# Altium schematic sheet imu_analog.SchDoc
size C
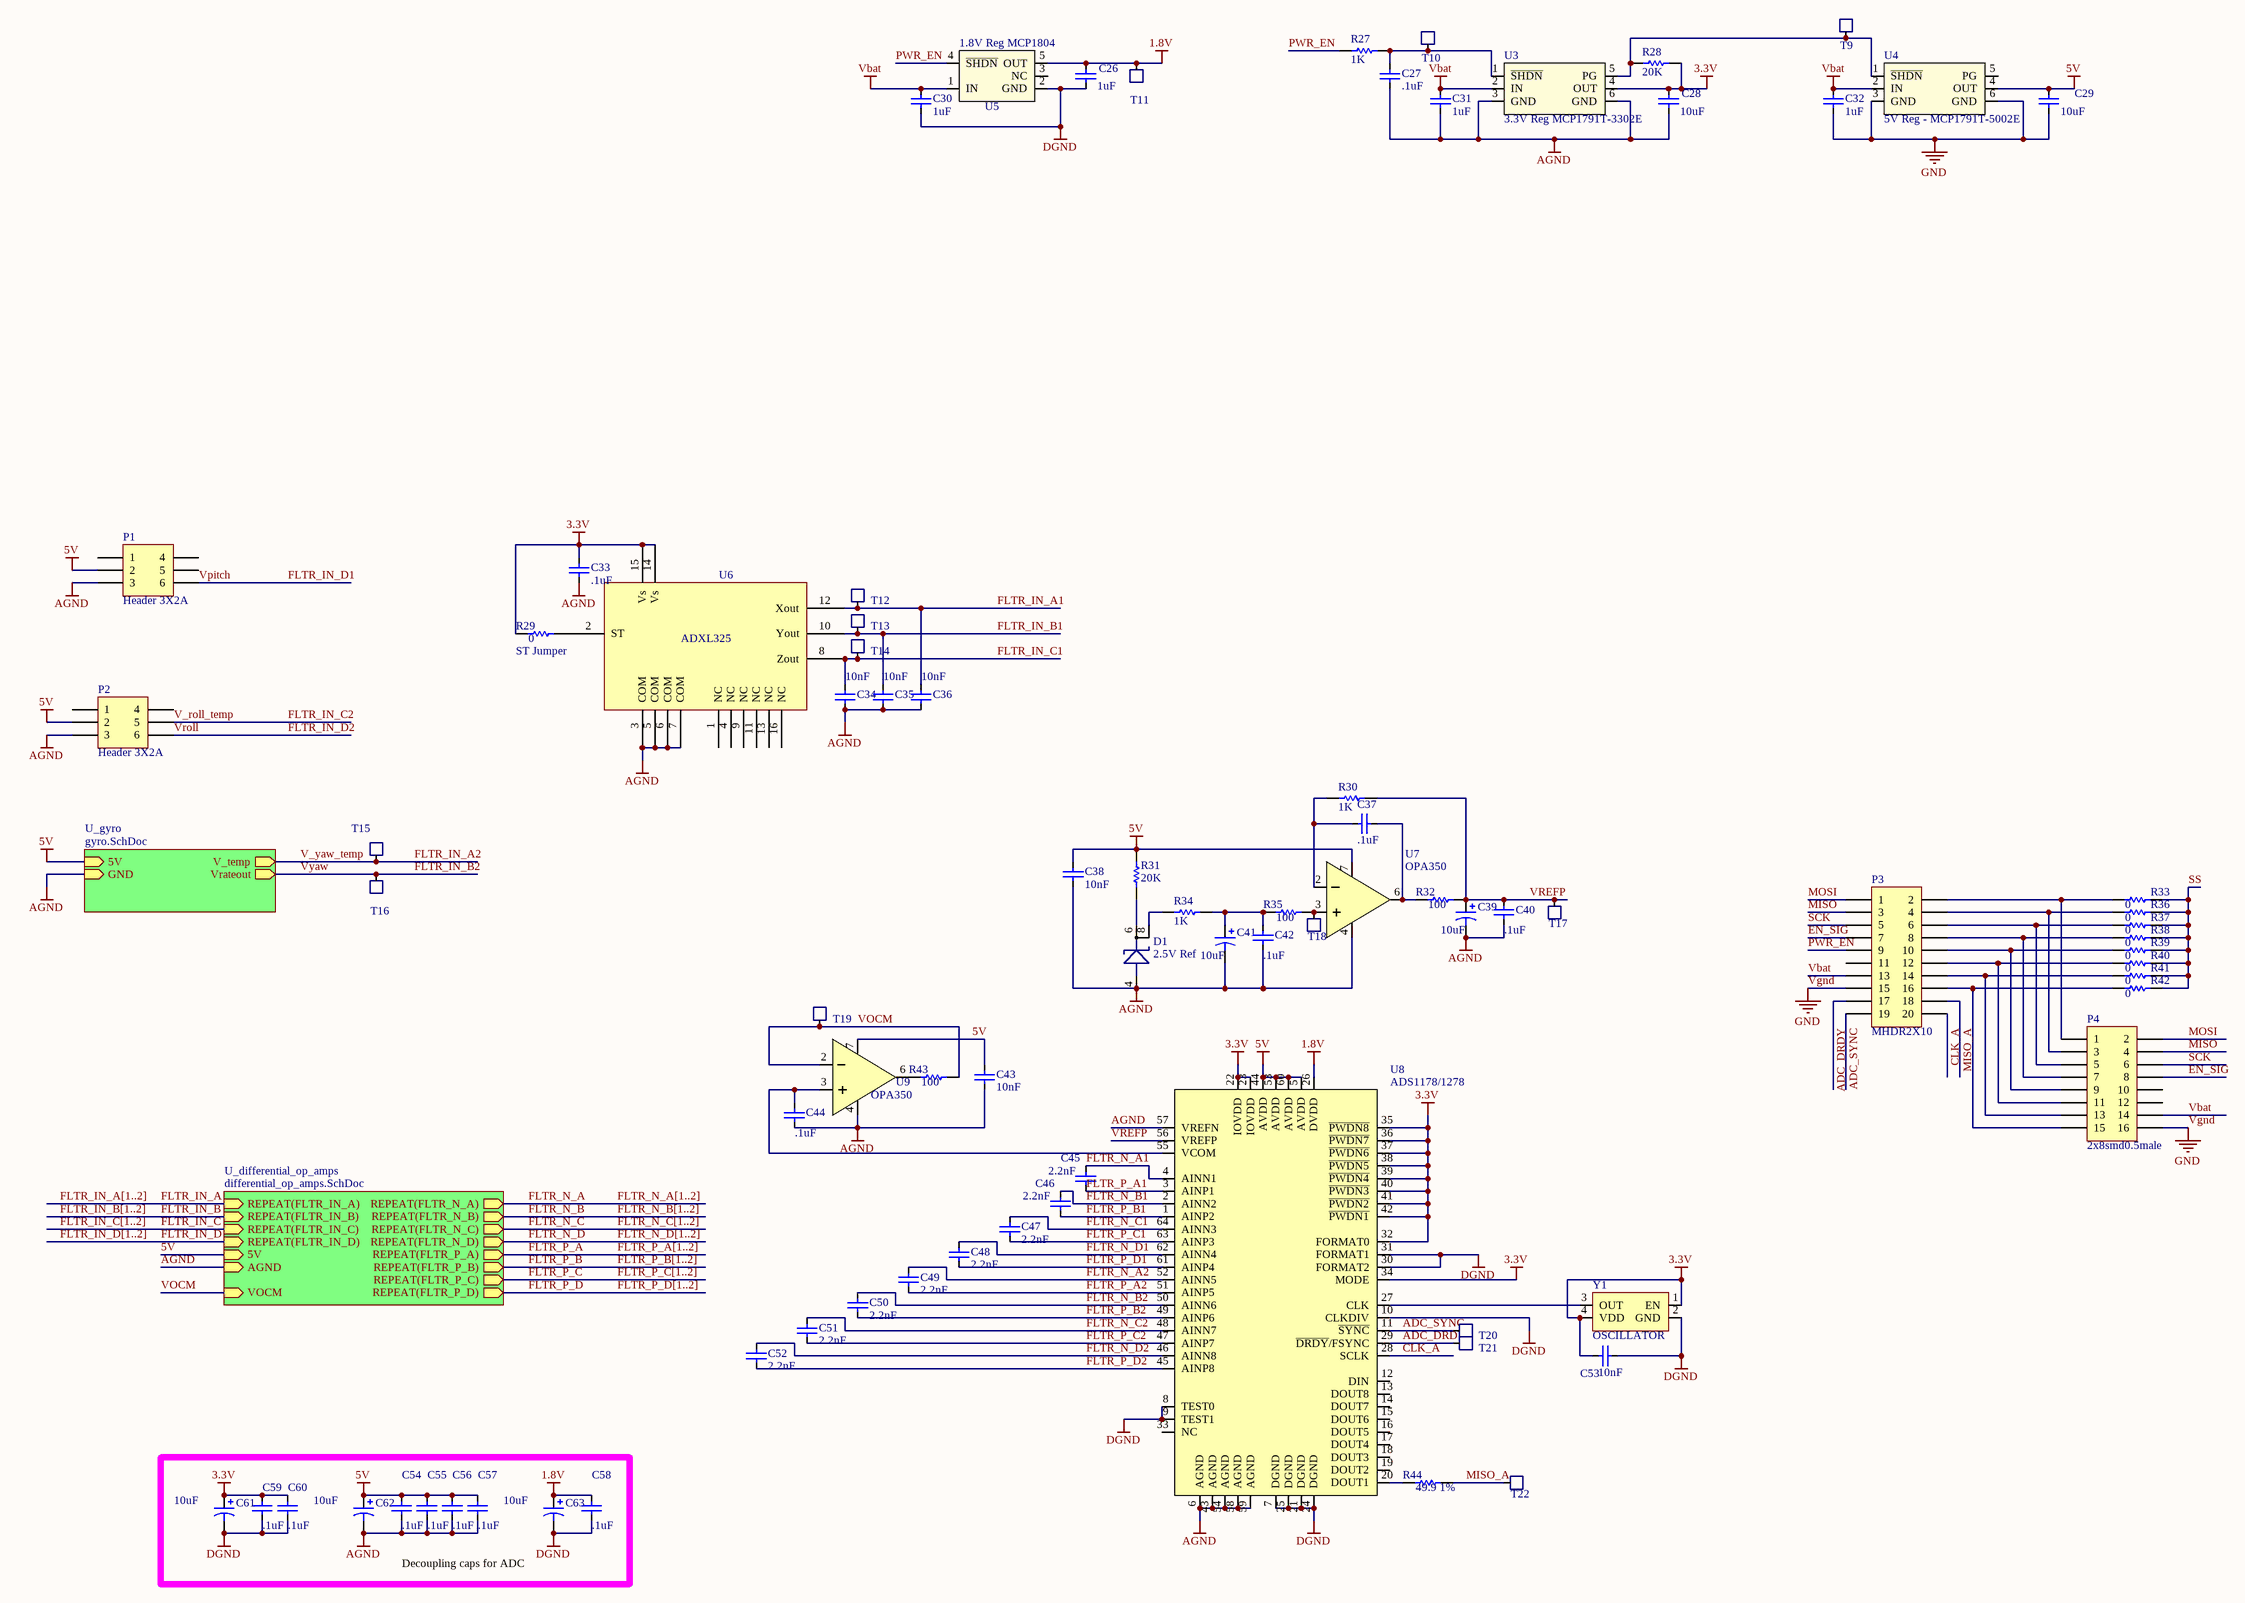
[diagram p0: imu_analog.SchDoc]

## Parts
C26  1uF  [0603 (1608)]
C27  value .1uF  [0603 (1608)]  (hidden comment: Capacitor)
C28  10uF  [0603 (1608)]
C29  10uF  [0603 (1608)]
C30  1uF  [0603 (1608)]
C31  value 1uF  [0603 (1608)]  (hidden comment: Capacitor)
C32  value 1uF  [0603 (1608)]  (hidden comment: Capacitor)
C33  value .1uF  [0603 (1608)]  (hidden comment: Capacitor)
C34  10nF  [0603 (1608)]
C35  10nF  [0603 (1608)]
C36  10nF  [0603 (1608)]
C37  value .1uF  [0603 (1608)]  (hidden comment: Capacitor)
C38  10nF  [0603 (1608)]
C39  value 10uF  [CAP-POL 0603(1608)]  (hidden comment: tant)
C40  value .1uF  [0603 (1608)]  (hidden comment: Capacitor)
C41  value 10uF  [CAP-POL 0603(1608)]  (hidden comment: tant)
C42  value .1uF  [0603 (1608)]  (hidden comment: Capacitor)
C43  10nF  [0603 (1608)]
C44  value .1uF  [0603 (1608)]  (hidden comment: Capacitor)
C45  value 2.2nF  [0603 (1608)]  (hidden comment: Capacitor)
C46  value 2.2nF  [0603 (1608)]  (hidden comment: Capacitor)
C47  value 2.2nF  [0603 (1608)]  (hidden comment: Capacitor)
C48  value 2.2nF  [0603 (1608)]  (hidden comment: Capacitor)
C49  value 2.2nF  [0603 (1608)]  (hidden comment: Capacitor)
C50  value 2.2nF  [0603 (1608)]  (hidden comment: Capacitor)
C51  value 2.2nF  [0603 (1608)]  (hidden comment: Capacitor)
C52  value 2.2nF  [0603 (1608)]  (hidden comment: Capacitor)
C53  10nF  [0603 (1608)]
C54  value .1uF  [0603 (1608)]  (hidden comment: Capacitor)
C55  value .1uF  [0603 (1608)]  (hidden comment: Capacitor)
C56  value .1uF  [0603 (1608)]  (hidden comment: Capacitor)
C57  value .1uF  [0603 (1608)]  (hidden comment: Capacitor)
C58  value .1uF  [0603 (1608)]  (hidden comment: Capacitor)
C59  value .1uF  [0603 (1608)]  (hidden comment: Capacitor)
C60  value .1uF  [0603 (1608)]  (hidden comment: Capacitor)
C61  value 10uF  [CAP-POL 0603(1608)]  (hidden comment: tant)
C62  value 10uF  [CAP-POL 0603(1608)]  (hidden comment: tant)
C63  value 10uF  [CAP-POL 0603(1608)]  (hidden comment: tant)
D1  2.5V Ref  [SOIC-8]
P1  Header 3X2A  [HDR2X3_CEN]
P2  Header 3X2A  [HDR2X3_CEN]
P3  MHDR2X10  [S9013E-10-ND]
P4  2x8smd0.5male  [S9007E-08-ND]
R27  1K  [0603 (1608)]
R28  20K  [0603 (1608)]
R29  ST Jumper  value 0  [0603 (1608)]
R30  1K  [0603 (1608)]
R31  20K  [0603 (1608)]
R32  100  [0603 (1608)]
R33  value 0  [0603 (1608)]  (hidden comment: Res1)
R34  1K  [0603 (1608)]
R35  100  [0603 (1608)]
R36  value 0  [0603 (1608)]  (hidden comment: Res1)
R37  value 0  [0603 (1608)]  (hidden comment: Res1)
R38  value 0  [0603 (1608)]  (hidden comment: Res1)
R39  value 0  [0603 (1608)]  (hidden comment: Res1)
R40  value 0  [0603 (1608)]  (hidden comment: Res1)
R41  value 0  [0603 (1608)]  (hidden comment: Res1)
R42  value 0  [0603 (1608)]  (hidden comment: Res1)
R43  100  [0603 (1608)]
R44  value 49.9 1%  [0603 (1608)]  (hidden comment: 931 1%)
T9  TEST_PAD  [TEST_PAD]  (value not drawn)
T10  TEST_PAD  [TEST_PAD]  (value not drawn)
T11  TEST_PAD  [TEST_PAD]  (value not drawn)
T12  (no value)  [TEST_PAD]
T13  (no value)  [TEST_PAD]
T14  (no value)  [TEST_PAD]
T15  (no value)  [TEST_PAD]
T16  (no value)  [TEST_PAD]
T17  (no value)  [TEST_PAD]
T18  (no value)  [TEST_PAD]
T19  (no value)  [TEST_PAD]
T20  (no value)  [TEST_PAD]
T21  (no value)  [TEST_PAD]
T22  TEST_PAD  [TEST_PAD]  (value not drawn)
U3  3.3V Reg MCP1791T-3302E  [SOT223 - 5 leads + tab]
U4  5V Reg - MCP1791T-5002E  [SOT223 - 5 leads + tab]
U5  1.8V Reg MCP1804  [SOT23-5 - MCP1804T]
U6  ADXL325  [LFCSP_LQ_AXDL]
U7  OPA350  [MSOP-8]
U8  ADS1178/1278  [S-PQFP-G64]
U9  OPA350  [MSOP-8]
Y1  OSCILLATOR  [ABRACON Oscillator]

## Blocks framed on the sheet
Decoupling caps for ADC: C54-C63

## Sub-sheets
U_differential_op_amps = differential_op_amps.SchDoc: REPEAT(FLTR_N_A) (out), REPEAT(FLTR_N_B) (out), REPEAT(FLTR_N_C) (out), REPEAT(FLTR_N_D) (out), REPEAT(FLTR_P_A) (out), REPEAT(FLTR_P_B) (out), REPEAT(FLTR_P_C) (out), REPEAT(FLTR_P_D) (out), REPEAT(FLTR_IN_A) (in), REPEAT(FLTR_IN_B) (in), REPEAT(FLTR_IN_C) (in), REPEAT(FLTR_IN_D) (in), 5V (in), AGND (in), VOCM (in)
U_gyro = gyro.SchDoc: V_temp (out), Vrateout (out), 5V (in), GND (in)

## Nets
1.8V: C26.1 C58.1 C63.1 T11.0 U5.5(OUT) U8.26(DVDD)
3.3V: C28.1 C33.1 C53.2 C59.1 C60.1 C61.1 R28.1 R29.1 U3.4(OUT) U6.14(Vs) U6.15(Vs) U8.22(IOVDD) U8.23(IOVDD) U8.32(FORMAT0) U8.34(MODE) U8.35(~{PWDN8}) U8.36(~{PWDN7}) U8.37(~{PWDN6}) U8.38(~{PWDN5}) U8.39(~{PWDN4}) U8.40(~{PWDN3}) U8.41(~{PWDN2}) U8.42(~{PWDN1}) Y1.1(EN) Y1.4(VDD)
5V: C29.1 C38.2 C43.2 C54.1 C55.1 C56.1 C57.1 C62.1 P1.2 P2.2 R31.2 U4.4(OUT) U7.7(V+) U8.5(AVDD) U8.44(AVDD) U8.53(AVDD) U8.60(AVDD) U9.7(V+) ; sheet U_differential_op_amps/5V, sheet U_gyro/5V
AGND: C27.2 C28.2 C31.2 C33.2 C34.1 C35.1 C36.1 C38.1 C39.2 C40.2 C41.2 C42.2 C43.1 C44.2 C54.2 C55.2 C56.2 C57.2 C62.2 D1.4(Anode) P1.3 P2.3 U3.3(GND) U3.6(GND) U6.3(COM) U6.5(COM) U6.6(COM) U6.7(COM) U7.4(V-) U8.6(AGND) U8.43(AGND) U8.54(AGND) U8.57(VREFN) U8.58(AGND) U8.59(AGND) U9.4(V-) ; sheet U_differential_op_amps/AGND, sheet U_gyro/GND
DGND: C26.2 C30.2 C53.1 C58.2 C59.2 C60.2 C61.2 C63.2 U5.2(GND) U8.7(DGND) U8.8(TEST0) U8.9(TEST1) U8.10(CLKDIV) U8.21(DGND) U8.24(DGND) U8.25(DGND) U8.30(FORMAT2) U8.31(FORMAT1) Y1.2(GND)
Vbat: C30.1 C31.1 C32.1 P3.13 P4.14 U3.2(IN) U4.2(IN) U5.1(IN)
Vgnd: C29.2 C32.2 P3.15 P4.16 U4.3(GND) U4.6(GND)  [also labelled GND]
ADC_DRDY: P3.17 T21.0 U8.29(~{DRDY}/FSYNC)
ADC_SYNC: P3.19 T20.0 U8.11(~{SYNC})
CLK_A: P3.20 U8.28(SCLK)
EN_SIG: P3.7 P4.8
FLTR_IN_A: sheet U_differential_op_amps/REPEAT(FLTR_IN_A)
FLTR_IN_A1: C36.2 T12.0 U6.12(Xout)
FLTR_IN_A2: T15.0 ; sheet U_gyro/V_temp  [also labelled V_yaw_temp]
FLTR_IN_B: sheet U_differential_op_amps/REPEAT(FLTR_IN_B)
FLTR_IN_B1: C35.2 T13.0 U6.10(Yout)
FLTR_IN_B2: T16.0 ; sheet U_gyro/Vrateout  [also labelled Vyaw]
FLTR_IN_C: sheet U_differential_op_amps/REPEAT(FLTR_IN_C)
FLTR_IN_C1: C34.2 T14.0 U6.8(Zout)
FLTR_IN_C2: P2.5  [also labelled V_roll_temp]
FLTR_IN_D: sheet U_differential_op_amps/REPEAT(FLTR_IN_D)
FLTR_IN_D1: P1.6  [also labelled Vpitch]
FLTR_IN_D2: P2.6  [also labelled Vroll]
FLTR_N_A: sheet U_differential_op_amps/REPEAT(FLTR_N_A)
FLTR_N_A1: C45.2 U8.4(AINN1)
FLTR_N_A2: C49.2 U8.52(AINN5)
FLTR_N_B: sheet U_differential_op_amps/REPEAT(FLTR_N_B)
FLTR_N_B1: C46.2 U8.2(AINN2)
FLTR_N_B2: C50.2 U8.50(AINN6)
FLTR_N_C: sheet U_differential_op_amps/REPEAT(FLTR_N_C)
FLTR_N_C1: C47.2 U8.64(AINN3)
FLTR_N_C2: C51.2 U8.48(AINN7)
FLTR_N_D: sheet U_differential_op_amps/REPEAT(FLTR_N_D)
FLTR_N_D1: C48.2 U8.62(AINN4)
FLTR_N_D2: C52.2 U8.46(AINN8)
FLTR_P_A: sheet U_differential_op_amps/REPEAT(FLTR_P_A)
FLTR_P_A1: C45.1 U8.3(AINP1)
FLTR_P_A2: C49.1 U8.51(AINP5)
FLTR_P_B: sheet U_differential_op_amps/REPEAT(FLTR_P_B)
FLTR_P_B1: C46.1 U8.1(AINP2)
FLTR_P_B2: C50.1 U8.49(AINP6)
FLTR_P_C: sheet U_differential_op_amps/REPEAT(FLTR_P_C)
FLTR_P_C1: C47.1 U8.63(AINP3)
FLTR_P_C2: C51.1 U8.47(AINP7)
FLTR_P_D: sheet U_differential_op_amps/REPEAT(FLTR_P_D)
FLTR_P_D1: C48.1 U8.61(AINP4)
FLTR_P_D2: C52.1 U8.45(AINP8)
MISO: P3.3 P4.4
MISO_A: P3.18 R44.2 T22.0
MOSI: P3.1 P4.2
PWR_EN: P3.9 R27.1 U5.4(~{SHDN})
SCK: P3.5 P4.6
SS: R33.2 R36.2 R37.2 R38.2 R39.2 R40.2 R41.2 R42.2
VOCM: R43.2 T19.0 U9.2(-IN) ; sheet U_differential_op_amps/VOCM
VREFP: C39.1 C40.1 R30.2 R32.2 T17.0 U8.56(VREFP)
NetC27_1: C27.1 R27.2 T10.0 U3.1(~{SHDN})
NetC37_1: C37.1 R30.1 U7.2(-IN)
NetC37_2: C37.2 R32.1 U7.6(Out)
NetC41_1: C41.1 C42.1 R34.2 R35.1
NetC44_1: C44.1 U8.55(VCOM) U9.3(+IN)
NetD1_6: D1.6(Cathode) R31.1
NetD1_8: D1.8(Cathode) R34.1
NetP3_2: P3.2 P4.1 R33.1
NetP3_4: P3.4 P4.3 R36.1
NetP3_6: P3.6 P4.5 R37.1
NetP3_8: P3.8 P4.7 R38.1
NetP3_10: P3.10 P4.9 R39.1
NetP3_12: P3.12 P4.11 R40.1
NetP3_14: P3.14 P4.13 R41.1
NetP3_16: P3.16 P4.15 R42.1
NetR28_2: R28.2 T9.0 U3.5(PG) U4.1(~{SHDN})
NetR29_2: R29.2 U6.2(ST)
NetR35_2: R35.2 T18.0 U7.3(+IN)
NetR43_1: R43.1 U9.6(Out)
NetR44_1: R44.1 U8.20(DOUT1)
NetU8_27: U8.27(CLK) Y1.3(OUT)

Not connected (* = marked no-connect by the designer): P1 1 4 5; P2 1 4; P3 11; P4 10 12; U4 5(PG); U5 3(NC); U6 1(NC) 4(NC) 9(NC) 11(NC) 13(NC) 16(NC); U8 12(DIN) 13(DOUT8) 14(DOUT7) 15(DOUT6) 16(DOUT5) 17(DOUT4) 18(DOUT3) 19(DOUT2) 33(NC)

## Buses and harness runs
bus FLTR_IN_A[1..2]
bus FLTR_IN_B[1..2]
bus FLTR_IN_C[1..2]
bus FLTR_IN_D[1..2]
bus FLTR_N_A[1..2]
bus FLTR_N_B[1..2]
bus FLTR_N_C[1..2]
bus FLTR_N_D[1..2]
bus FLTR_P_A[1..2]
bus FLTR_P_B[1..2]
bus FLTR_P_C[1..2]
bus FLTR_P_D[1..2]

## Library data of the parts
C26 C30-C32 = Capacitor: Manufacturer: Murata; Part No.: 81-GRM188R61E105KA12; Vendor: Mouser; Tolerance: 10%; Voltage: 25V; Price Est.: $0.08
  C26 C30: Value: 1uF
C27 C33 C37 C40 C42 C44 C54-C60 = Capacitor: Manufacturer: Murata; Part No.: 490-1524-1-ND; Vendor: Digikey; Price Est.: $0.019
C28 C29 = Capacitor: Manufacturer: Murata; Part No.: 810-C1608X5R0J106K; Vendor: Mouser; Tolerance: 10%; Voltage: 6.3V; Price Est.: $0.56; Value: 10uF
C34-C36 C38 C43 C53 = Capacitor: Manufacturer: TDK; Part No.: 445-5099-1-ND; Vendor: Digikey; Tolerance: 5%; Price Est.: $0.044; Value: 10nF
C39 C41 C61-C63 = Cap Pol3: Polarized Capacitor (Surface Mount); Part No.: 71-298D106X06R3M2T; Special: Tantalum; Estimated Cost: $1.21; Vendor: Mouser
C45-C52 = Capacitor: COG Ceramic Cap -> near input to ads1178; Manufacturer: Murata; Part No.: 490-1459-1-ND; Vendor: Digikey; Special: COG, NPO; Price Est.: $0.078
D1 = ZENER: REF1004 - 2.5 volt ref; Part No.: REF1004C-2.5-ND; Manufacturer: Texas Instruments; Vendor: Digikey; Price Est.: $4.12
P1 P2 = Header 3X2A: Header, 3-Pin, Dual row; LatestRevisionDate: 17-Jul-2002; LatestRevisionNote: Re-released for DXP Platform.; Publisher: Altium Limited
P3 = MHDR2X10: Header, 10-Pin, Female; Part No.: S9007E-10-ND; Vendor: Digikey; Price Est.: $2.28
P4 = 2x8smd0.5male: Part No.: S9013E-08-ND; Vendor: Digikey; Price Est.: 1.43
R27 R30 R34 = Res1: Resistor; Part No.: P1.0KGCT-ND; Vendor: Digikey; Estimated Cost: $0.03; Tolerance: 5%; Value: 1K
R28 R31 = Res1: Resistor; Part No.: P20KGCT-ND; Vendor: Digikey; Value: 20K; Price Est.: $0.03
R29 R33 R36-R42 = Res1: Resistor; Published: 8-Jun-2000; LatestRevisionDate: 17-Jul-2002; LatestRevisionNote: Re-released for DXP Platform.; PackageReference: AXIAL-0.3; Publisher: Altium Limited
R32 R35 R43 = Res1: Resistor; Part No.: P100GCT-ND; Vendor: Digikey; Value: 100; Price Est.: $0.03
R44 = Res1: Resistor; Part No.: P49.9HCT-ND; Vendor: Digikey; Price Est.: $0.04
T12-T21 = TEST_PAD
U3 = 5V Reg - MCP1791T-5002E/DC: 3.3V, 70mA LDO with SHDN and PWRGD pins; Part No.: MCP1791T-3302E/DCCT-ND; Vendor: Digikey; Price Est.: $0.90
U4 = 5V Reg - MCP1791T-5002E/DC: 5V, 70mA LDO with SHDN and PWRGD pins; Part No.: MCP1791T-5002E/DCCT-ND; Vendor: Digikey; Price Est.: $0.90
U5 = 1.8V Reg: 1.8V Reg. MCP1804; Part No.: MCP1804T-1802I/OTCT-ND; Vendor: Digikey; Price Est.: $0.81
U6 = ADXL325: Part No.: ADXL325BCPZ-RL7CT-ND; Vendor: Digikey; Price Est.: $4.82
U8 = ADS1178: The ADS1178 and 1278 are pin compatible. 16 and 24 bits, respectively.; Manufacturer: Texas Instruments; Vendor: Digikey; Price Est.: $21.00
Y1 = OSCILLATOR: Part No.: 535-9778-1-ND; Manufacturer: Abracon; Frequency: 1.8432 MHz; Vendor: Digikey; Price Est.: $2.93